# Altium schematic sheet TopLevel.SchDoc
size 431 x 279 mm; Organization: ORGANIZATION; Address1: ADDRESS 1; Address2: ADDRESS 2; Address3: ADDRESS 3; Address4: ADDRESS 4; Revision: -; SheetNumber: 1; SheetTotal: 8; ENG_APP_DATE: --/--/--; DSN_APP_DATE: --/--/--; CHK_APP_DATE: --/--/--
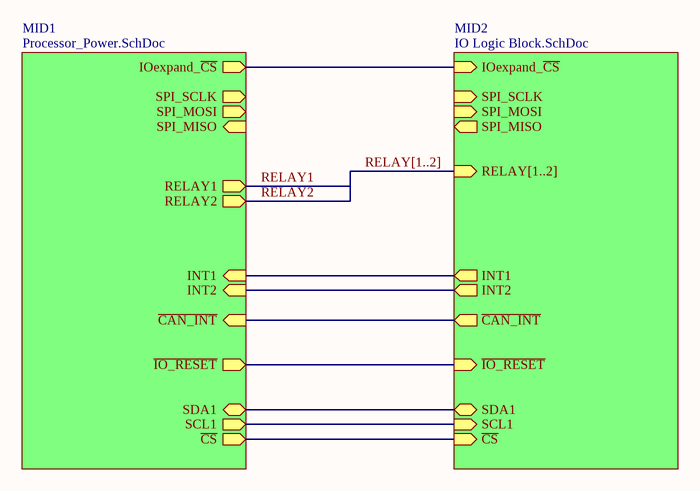
[diagram p0: TopLevel.SchDoc]

## Sub-sheets
MID1 = Processor_Power.SchDoc: SDA1 (bidir), SCL1 (out), IOexpand_~{CS} (out), SPI_MOSI (out), SPI_MISO (in), SPI_SCLK (out), ~{CS} (out), RELAY1 (out), INT1 (in), RELAY2 (out), INT2 (in), ~{IO_RESET} (out), ~{CAN_INT} (in)
MID2 = IO Logic Block.SchDoc: RELAY[1..2] (in), ~{IO_RESET} (in), ~{CAN_INT} (out), IOexpand_~{CS} (in), SPI_SCLK (in), SPI_MOSI (in), SPI_MISO (out), INT1 (out), INT2 (out), SDA1 (bidir), SCL1 (in), ~{CS} (in)

## Nets
RELAY1: sheet MID1/RELAY1
RELAY2: sheet MID1/RELAY2
(unnamed): sheet MID1/SDA1, sheet MID2/SDA1
(unnamed): sheet MID1/SCL1, sheet MID2/SCL1
(unnamed): sheet MID1/IOexpand_~{CS}, sheet MID2/IOexpand_~{CS}
(unnamed): sheet MID1/~{CS}, sheet MID2/~{CS}
(unnamed): sheet MID1/INT1, sheet MID2/INT1
(unnamed): sheet MID1/INT2, sheet MID2/INT2
(unnamed): sheet MID1/~{IO_RESET}, sheet MID2/~{IO_RESET}
(unnamed): sheet MID1/~{CAN_INT}, sheet MID2/~{CAN_INT}

## Buses and harness runs
bus RELAY[1..2] = sheet MID2/RELAY[1..2]

## Notes on the sheet
- DWG. NO.
- REV.
- SHT.
- THIS DOCUMENT AND THE DATA DISCLOSED HEREIN OR HEREWITH IS THE PROPERTY OF ALTIUM LIMITED AND MAY BE FREELY DISTRIBUTED IN WHOLE. NO RIGHTS ARE RESERVED OR EXPRESS OR IMPLIED WARANTEE GIVEN.
- REVISION
- DESCRIPTION
- DATE
- APPROVED
- ENG:
- DSN:
- APPROVALS
- PROJECT REVISION:
- www.altium.com <http://www.altium.com>
- DOCUMENT REVISION:
- 92037, La Jolla
- USA
- Altium Ltd.
- 4225 Executive Square
- CHK:
- REFERENCE DOCUMENTS
- DESIGN ITEM:
- TITLE
- VARIANT
- BOM:
- FAB DWG:
- PCB DWG:
- ASSY DWG:
- SCALE:
- SIZE
- B
- CAGE CODE
- FILE NAME
- DWG NO.
- SHEET
- OF
- REV